# EAGLE design thermoscheme (EAGLE 9.6.1)
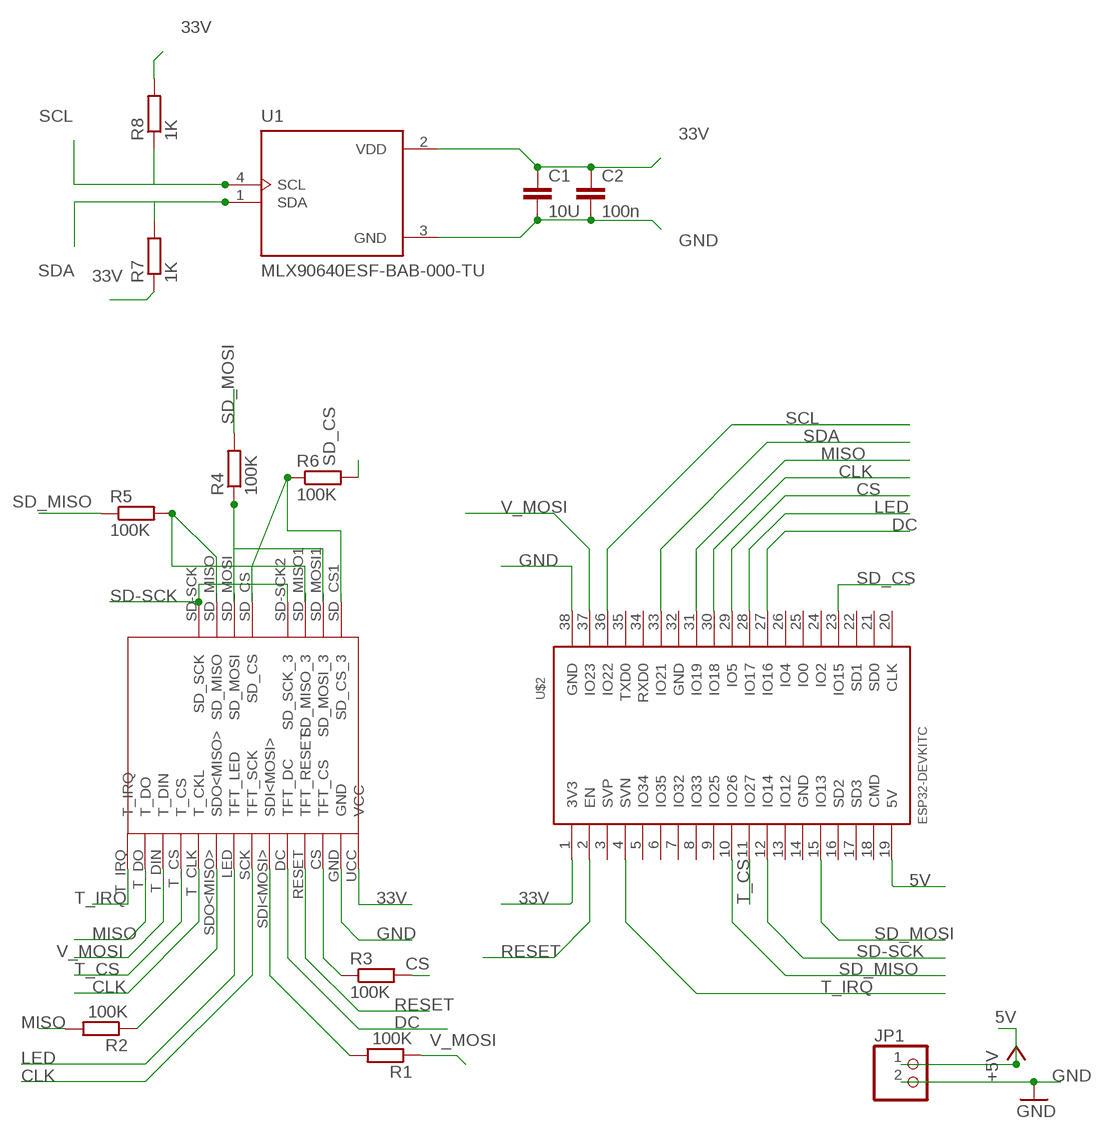
[diagram p0: schematic, sheet 1]

## Parts
C1  10U  C2,5-3  [C2.5-3]
C2  100n  C2,5-3  [C2.5-3]
JP1  PINHD-1X2  [1X02]
R1  100K  R-EU_0207/10  [0207/10]
R2  100K  R-EU_0207/10  [0207/10]
R3  100K  R-EU_0207/10  [0207/10]
R4  100K  R-EU_0207/10  [0207/10]
R5  100K  R-EU_0207/10  [0207/10]
R6  100K  R-EU_0207/10  [0207/10]
R7  1K  R-EU_0204/7  [0204/7]
R8  1K  R-EU_0204/7  [0204/7]
U1  MLX90640ESF-BAB-000-TU  [TO292P945H1165-4]
U$2  ESP32DEVKITC  [ESP32-DEVKITC]
U$3  ILI9341  [ILI9341]

## Nets
5V [supply]: JP1.1 U$2.19(5V) ; supply symbol labelled +5V
33V [supply]: C1.1 C2.1 R7.1 R8.2 U1.2(VDD) U$2.1(3V3) U$3.UCC(VCC)
CLK: U$2.30(IO18) U$3.SCK(TFT_SCK) U$3.T_CLK(T_CKL)
CS: R3.2 U$2.29(IO5)
DC: U$2.27(IO16) U$3.DC(TFT_DC)
GND: C1.2 C2.2 JP1.2 U1.3(GND) U$2.38(GND) U$3.GND
LED: U$2.28(IO17) U$3.LED(TFT_LED)
MISO: R2.2 U$2.31(IO19) U$3.T_DO
N$1: R5.2 U$3.SD_MISO U$3.SD_MISO1(SD_MISO_3)
N$2: R4.1 U$3.SD_MOSI U$3.SD_MOSI1(SD_MOSI_3)
N$3: R6.1 U$3.SD_CS U$3.SD_CS1(SD_CS_3)
N$4: R2.1 U$3.SDO<MISO>
N$5: R3.1 U$3.CS(TFT_CS)
N$6: R1.2 U$3.SDI<MOSI>
RESET: U$2.2(EN) U$3.RESET(TFT_RESET)
SCL: R8.1 U1.4(SCL) U$2.36(IO22)
SD-SCK: U$2.12(IO14) U$3.SD-SCK2(SD_SCK_3) U$3.SD-SCK(SD_SCK)
SD_CS: R6.2 U$2.23(IO15)
SD_MISO: R5.1 U$2.10(IO26)
SD_MOSI: R4.2 U$2.15(IO13)
SDA: R7.2 U1.1(SDA) U$2.33(IO21)
T_CS: U$2.11(IO27) U$3.T_CS
T_IRQ: U$2.4(SVN) U$3.T_IRQ
V_MOSI: R1.1 U$2.37(IO23) U$3.T_DIN
Unconnected: U$2.3(SVP) U$2.5(IO34) U$2.6(IO35) U$2.7(IO32) U$2.8(IO33) U$2.9(IO25) U$2.13(IO12) U$2.14(GND) U$2.16(SD2) U$2.17(SD3) U$2.18(CMD) U$2.20(CLK) U$2.21(SD0) U$2.22(SD1) U$2.24(IO2) U$2.25(IO0) U$2.26(IO4) U$2.32(GND) U$2.34(RXD0) U$2.35(TXD0)

## Library data of the parts
C1 C2 = capacitor-wima:C: CAPACITOR naming: grid - package width
JP1 = pinhead:PINHD-1X2: PIN HEADER
R1-R8 = rcl:R-EU_: RESISTOR, European symbol; SPICEPREFIX: R
U1 = teploblinEkran:MLX90640ESF-BAB-000-TU: SENSOR DGTL -40C-85C TO39; AVAILABILITY: Unavailable; DESCRIPTION: Thermal Image Sensor 32H x 24V TO-39; MF: Melexis Technologies NV; MP: MLX90640ESF-BAB-000-TU; PACKAGE: TO-39 Melexis Technologies NV; PRICE: None
U$2 = teploblinEkran:ESP32DEVKITC
U$3 = thermo:ILI9341

## Net classes
0 default: width 0.406 mm
1 supply: width 0.813 mm

## Board
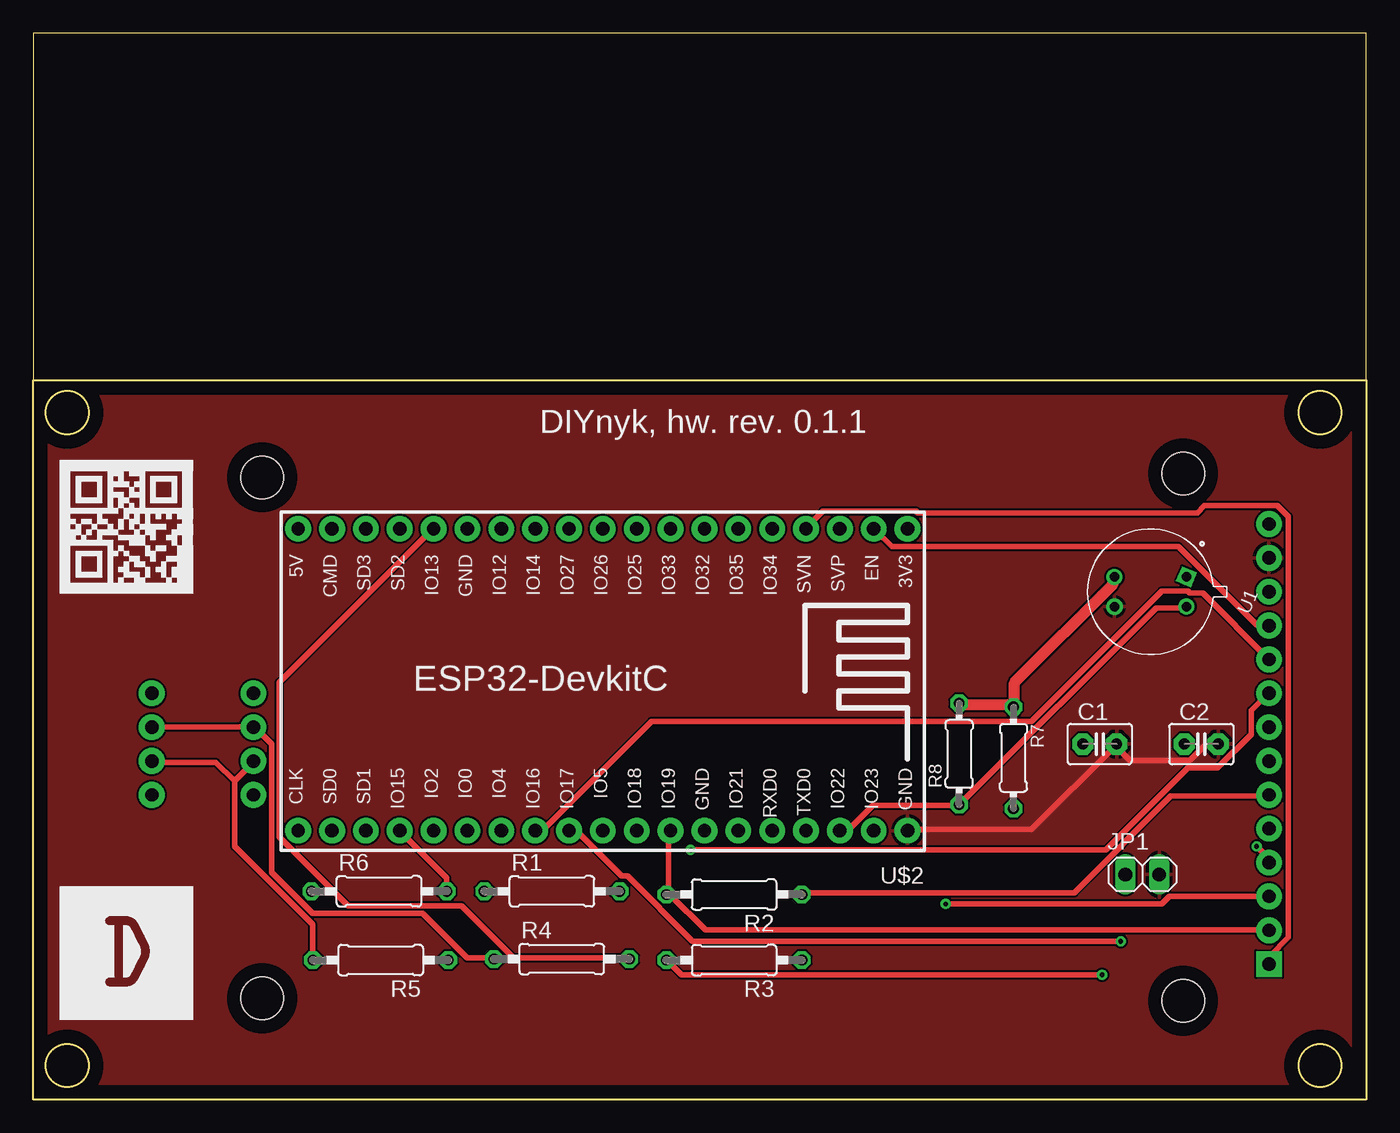
[diagram p1: board, top side]
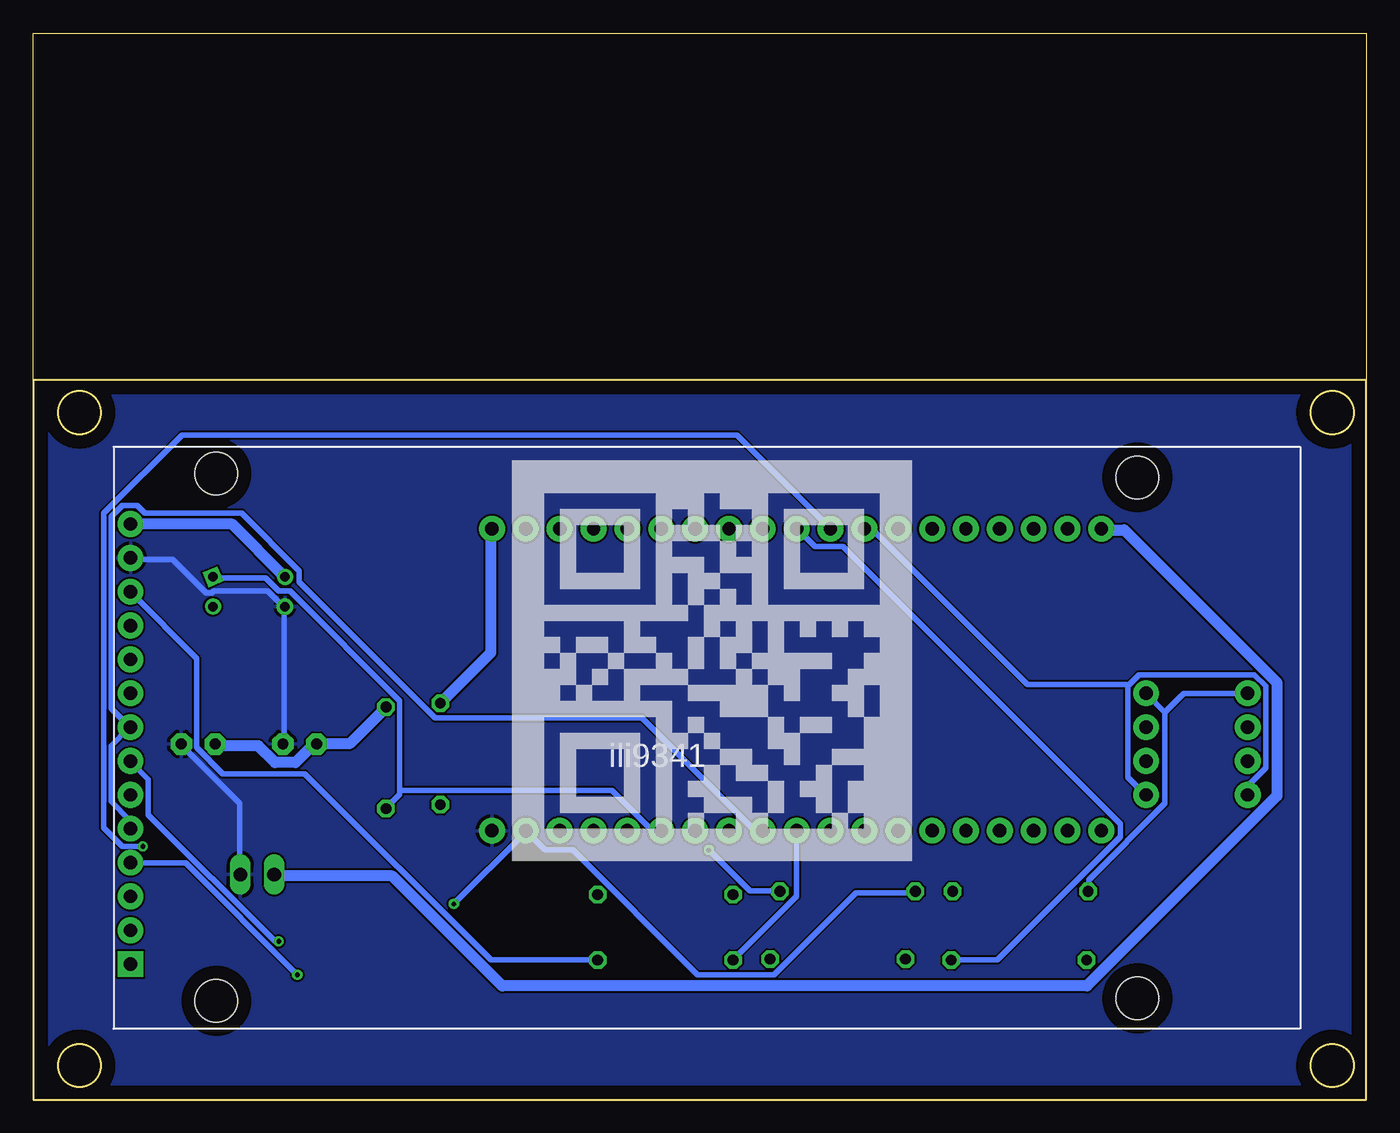
[diagram p2: board, bottom side, seen from below]

Size 100 x 80 mm. Coordinates in mm from the lower left corner, seen from the top.
Outline: 100,54 100,80 0,80 0,54
Outline: 0,54 100,54
Outline: 100,54 100,0 0,0 0,54
Outline: circle at 2.54,2.54 radius 1.6
Outline: circle at 96.54,2.54 radius 1.6
Outline: circle at 96.54,51.54 radius 1.6
Outline: circle at 2.54,51.54 radius 1.6
Copper layers (1*16): Top 0.035mm / dielectric 1.5mm / Bottom 0.035mm
Design rules "default": minimum track width 6mil, minimum drill 0.35mm, track to track 6mil, track to pad 6mil, pad to pad 6mil, via to via 6mil, smd to smd 6mil, copper to edge 40mil, drill to drill 6mil, minimum pad ring 10mil, minimum via ring 8mil, stop-mask expansion 4mil, vias tented up to drill 0mil, thermal gap 10mil

### Footprints (pad centres in the part's own frame; a part is rotated, then mirrored left to right if it is on the bottom)
C2.5-3 = drill 0.813 pad 1.6 octagon: 1 -1.27,0; 2 1.27,0
1X02 = drill 1.016 long: 1 -1.27,0; 2 1.27,0
0207/10 = drill 0.813 octagon: 1 -5.08,0; 2 5.08,0
0204/7 = drill 0.813 octagon: 1 -3.81,0; 2 3.81,0
TO292P945H1165-4 = drill 0.7 pad 1.1 square: 1 -2.065,2.067 | drill 0.7 pad 1.1: 2 0,-2.92; 3 2.065,-2.065; 4 0,2.92
ESP32-DEVKITC = drill 1 pad 1.93: 1 -22.87,-11.42; 2 -20.33,-11.42; 3 -17.79,-11.42; 4 -15.25,-11.42; 5 -12.71,-11.42; 6 -10.17,-11.42; 7 -7.63,-11.42; 8 -5.09,-11.42; 9 -2.55,-11.42; 10 -0.01,-11.42; 11 2.53,-11.42; 12 5.07,-11.42; 13 7.61,-11.42; 14 10.15,-11.42; 15 12.69,-11.42; 16 15.23,-11.42; 17 17.77,-11.42; 18 20.31,-11.42; 19 22.85,-11.42; 20 22.85,11.23; 21 20.31,11.23; 22 17.77,11.23; 23 15.23,11.23; 24 12.69,11.23; 25 10.15,11.23; 26 7.61,11.23; 27 5.07,11.23; 28 2.53,11.23; 29 -0.01,11.23; 30 -2.55,11.23; 31 -5.09,11.23; 32 -7.63,11.23; 33 -10.17,11.23; 34 -12.71,11.23; 35 -15.25,11.23; 36 -17.79,11.23; 37 -20.33,11.23; 38 -22.87,11.23
ILI9341 = drill 1 pad 1.93: CS -27.94,0; DC -22.86,0; GND -30.48,0; LED -15.24,0; RESET -25.4,0; SCK -17.78,0; SD-SCK -12.7,76.2; SD-SCK2 -12.7,83.82; SD_CS -20.32,76.2; SD_CS1 -20.32,83.82; SD_MISO -15.24,76.2; SD_MISO1 -15.24,83.82; SD_MOSI -17.78,76.2; SD_MOSI1 -17.78,83.82; SDI<MOSI> -20.32,0; SDO<MISO> -12.7,0; T_CLK -10.16,0; T_CS -7.62,0; T_DIN -5.08,0; T_DO -2.54,0; UCC -33.02,0 | drill 1 pad 1.93 square: T_IRQ 0,0 | hole 3.2: -36.525,75.54; 2.565,75.54; 2.76,6.44; -36.8,6.44

### Placement (x,y rotation side)
C1  80.01,26.67 0 top
C2  87.63,26.67 0 top
JP1  83.2,16.89 0 top
R1  38.91,15.62 0 top
R2  52.58,15.38 180 top
R3  52.58,10.46 180 top
R4  39.64,10.54 0 top
R5  26.06,10.46 180 top
R6  25.94,15.62 0 top
R7  73.54,25.64 270 top
R8  69.46,25.93 90 top
U1  83.82,38.1 247.6 top
U$1  [QR_30MM]  64,18 0 bottom
U$2  42.72,31.4 180 top
U$3  92.71,10.16 270 bottom
U$4  [QR_10MM]  2,38 0 top
U$5  [DIYNYK_10MM]  2,6 0 top

### Tracks (layer width: path | path; a pad name or v marks a point on that pad's centre or on a via)
5V
  Bottom 0.813: JP1.1 81.86,16.76 73.06,16.76 64.82,8.52 20.95,8.52 6.71,22.77 6.71,31.29 18.16,42.75 19.84,42.75 U$2.19
33V
  Top 0.813: U1.2 81.03,39.12 81.03,38.7 73.62,31.29 73.62,29.48 R7.1 73.2,29.62 69.57,29.62 R8.2
  Bottom 0.813: R7.1 73.62,29.34 76.28,26.68 78.65,26.68 C1.1 79.07,26.54 80.33,25.29 81.86,25.29 83.12,26.54 86.33,26.54 C2.1 | U$2.1 65.66,42.75 65.66,33.53 69.43,29.76 R8.2 | U$3.UCC 92.62,43.17 85.08,43.17 81.17,39.26 U1.2
CLK
  Bottom 0.406: U$2.30 45.4,20.26 45.96,20.26 54.34,28.64 69.85,28.64 80.05,38.84 80.05,39.67 84.38,44.01 91.64,44.01 92.2,44.56 93.32,44.56 94.16,43.73 94.16,29.34 92.76,27.94 U$3.SCK 92.9,27.8 94.16,26.54 94.16,22.35 92.76,20.95 92.76,20.4 U$3.T_CLK
CS  (via drill 0.35)
  Top 0.406: v80.19,9.36 48.62,9.36 47.64,10.34 R3.2
  Bottom 0.406: R3.2 47.5,10.48 42.75,15.23 42.75,20.12 U$2.29 | 92.62,17.74 88.57,17.74 v80.19,9.36
DC
  Top 0.406: U$3.DC 87.73,38 86.75,38 86.61,38.14 84.66,38.14 74.88,28.36 46.38,28.36 38.28,20.26 37.72,20.26 U$2.27
GND
  Top 0.406: U$2.38 65.66,20.26 74.88,20.26 81.17,26.54 C1.2 81.31,26.4 82.28,25.43 86.75,25.43 87.87,26.54 88.85,26.54 C2.2
  Bottom 0.406: JP1.2 84.52,16.9 84.52,22.21 88.85,26.54 C2.2 | C1.2 81.17,26.68 81.17,36.88 U1.3 81.31,37.02 82.42,38.14 86.47,38.14 86.61,38 87.03,38 89.55,40.51 92.62,40.51 U$3.GND
  pour Top: 0,54 0,0 100,0 100,54
  pour Bottom: -1,54 -1,-2 101,-2 101,55 0,55
LED  (via drill 0.35)
  Top 0.406: v81.58,11.87 49.45,11.87 44.56,16.76 44.15,16.76 40.79,20.12 40.23,20.12 U$2.28
  Bottom 0.406: v81.58,11.87 81.86,11.87 91.36,21.37 91.36,24.03 92.62,25.29 U$3.LED
MISO
  Top 0.406: U$2.31 47.78,20.12 47.64,19.98 47.64,15.51 R2.2 47.78,15.37 50.43,12.71 92.62,12.71 U$3.T_DO
N$1
  Top 0.406: 15.09,23.89 15.09,19 20.95,13.13 20.95,10.48 R5.2 | 15.09,23.89 16.48,25.29 U$3.SD_MISO | 15.09,23.89 13.69,25.29 8.94,25.29 U$3.SD_MISO1
N$2
  Top 0.406: R4.1 34.51,10.62 32.55,10.62 29.2,13.97 20.95,13.97 17.88,17.04 17.88,26.68 16.62,27.94 U$3.SD_MOSI U$3.SD_MOSI1
N$3
  Bottom 0.406: 15.09,29.06 15.09,22.21 20.82,16.48 20.82,15.65 R6.1 | U$3.SD_CS 15.09,29.06 | 15.09,29.06 13.69,30.45 8.94,30.45 U$3.SD_CS1
N$4
  Top 0.406: R2.1 57.7,15.51 78.09,15.51 85.36,22.77 92.62,22.77 U$3.SDO<MISO>
N$5
  Bottom 0.406: R3.1 57.7,10.48 65.66,10.48 79.63,24.45 85.78,24.45 87.73,26.4 87.73,33.11 92.62,38 U$3.CS
N$6  (via drill 0.35)
  Top 0.406: v49.31,18.72 80.47,18.72 86.61,24.87 88.85,24.87 91.36,27.38 91.36,29.2 92.62,30.45 U$3.SDI<MOSI>
  Bottom 0.406: v49.31,18.72 46.24,15.65 44.01,15.65 R1.2
RESET
  Top 0.406: U$3.RESET 92.62,35.62 91.78,35.62 85.92,41.49 64.4,41.49 63.14,42.75 U$2.2
SCL
  Top 0.406: U1.4 86.47,36.88 84.24,36.88 69.57,22.21 R8.1 69.29,22.07 63.01,22.07 61.19,20.26 60.63,20.26 U$2.36
SD-SCK
  Bottom 0.406: 17.88,31.01 17.04,31.85 8.38,31.85 7.54,31.01 7.54,24.87 8.8,23.61 8.8,22.91 U$3.SD-SCK2 | 17.88,31.01 17.88,24.17 16.62,22.91 U$3.SD-SCK | U$2.12 37.58,42.75 37.02,42.75 25.43,31.15 18.02,31.15 17.88,31.01
SD_CS
  Top 0.406: R6.2 31.01,15.65 31.01,16.62 27.52,20.12 U$2.23
SD_MISO
  Bottom 0.406: R5.1 31.01,10.48 27.66,10.48 18.44,19.7 18.44,20.68 39.26,41.49 41.35,41.49 42.61,42.75 U$2.10
SD_MOSI
  Top 0.406: R4.2 44.7,10.62 36.04,10.62 32.13,14.53 23.61,14.53 18.44,19.7 18.44,31.29 29.9,42.75 U$2.15
SDA
  Bottom 0.406: 72.5,23.19 72.5,22.91 73.48,21.93 R7.2 | 72.5,23.19 72.5,29.9 80.75,38.14 81.58,38.14 82.56,39.12 86.47,39.12 U1.1 | 72.5,23.19 56.58,23.19 53.65,20.26 52.95,20.26 U$2.33
T_CS  (via drill 0.35)
  Top 0.406: v91.78,19 92.62,18.16 92.62,17.88 U$3.T_CS
  Bottom 0.406: v91.78,19 93.32,19 94.72,20.4 94.72,44.01 88.85,49.87 47.22,49.87 40.23,42.89 U$2.11
T_IRQ
  Top 0.406: U$3.T_IRQ 92.76,10.2 92.76,10.76 94.16,12.15 94.16,43.73 93.32,44.56 87.87,44.56 87.31,44.01 66.36,44.01 66.22,44.15 59.23,44.15 57.98,42.89 U$2.4
V_MOSI  (via drill 0.35)
  Top 0.406: v68.45,14.67 84.66,14.67 85.22,15.23 92.62,15.23 U$3.T_DIN
  Bottom 0.406: R1.1 33.95,15.51 38.28,15.51 44.42,9.36 50.15,9.36 59.51,18.72 61.61,18.72 63.01,20.12 U$2.37 63.14,19.98 v68.45,14.67

### Text on the board
tPlace: DIYnyk, hw. rev. 0.1.1